# Altium schematic sheet PWR_MGMT.SchDoc
size B; SheetNumber: 3; SheetTotal: 5
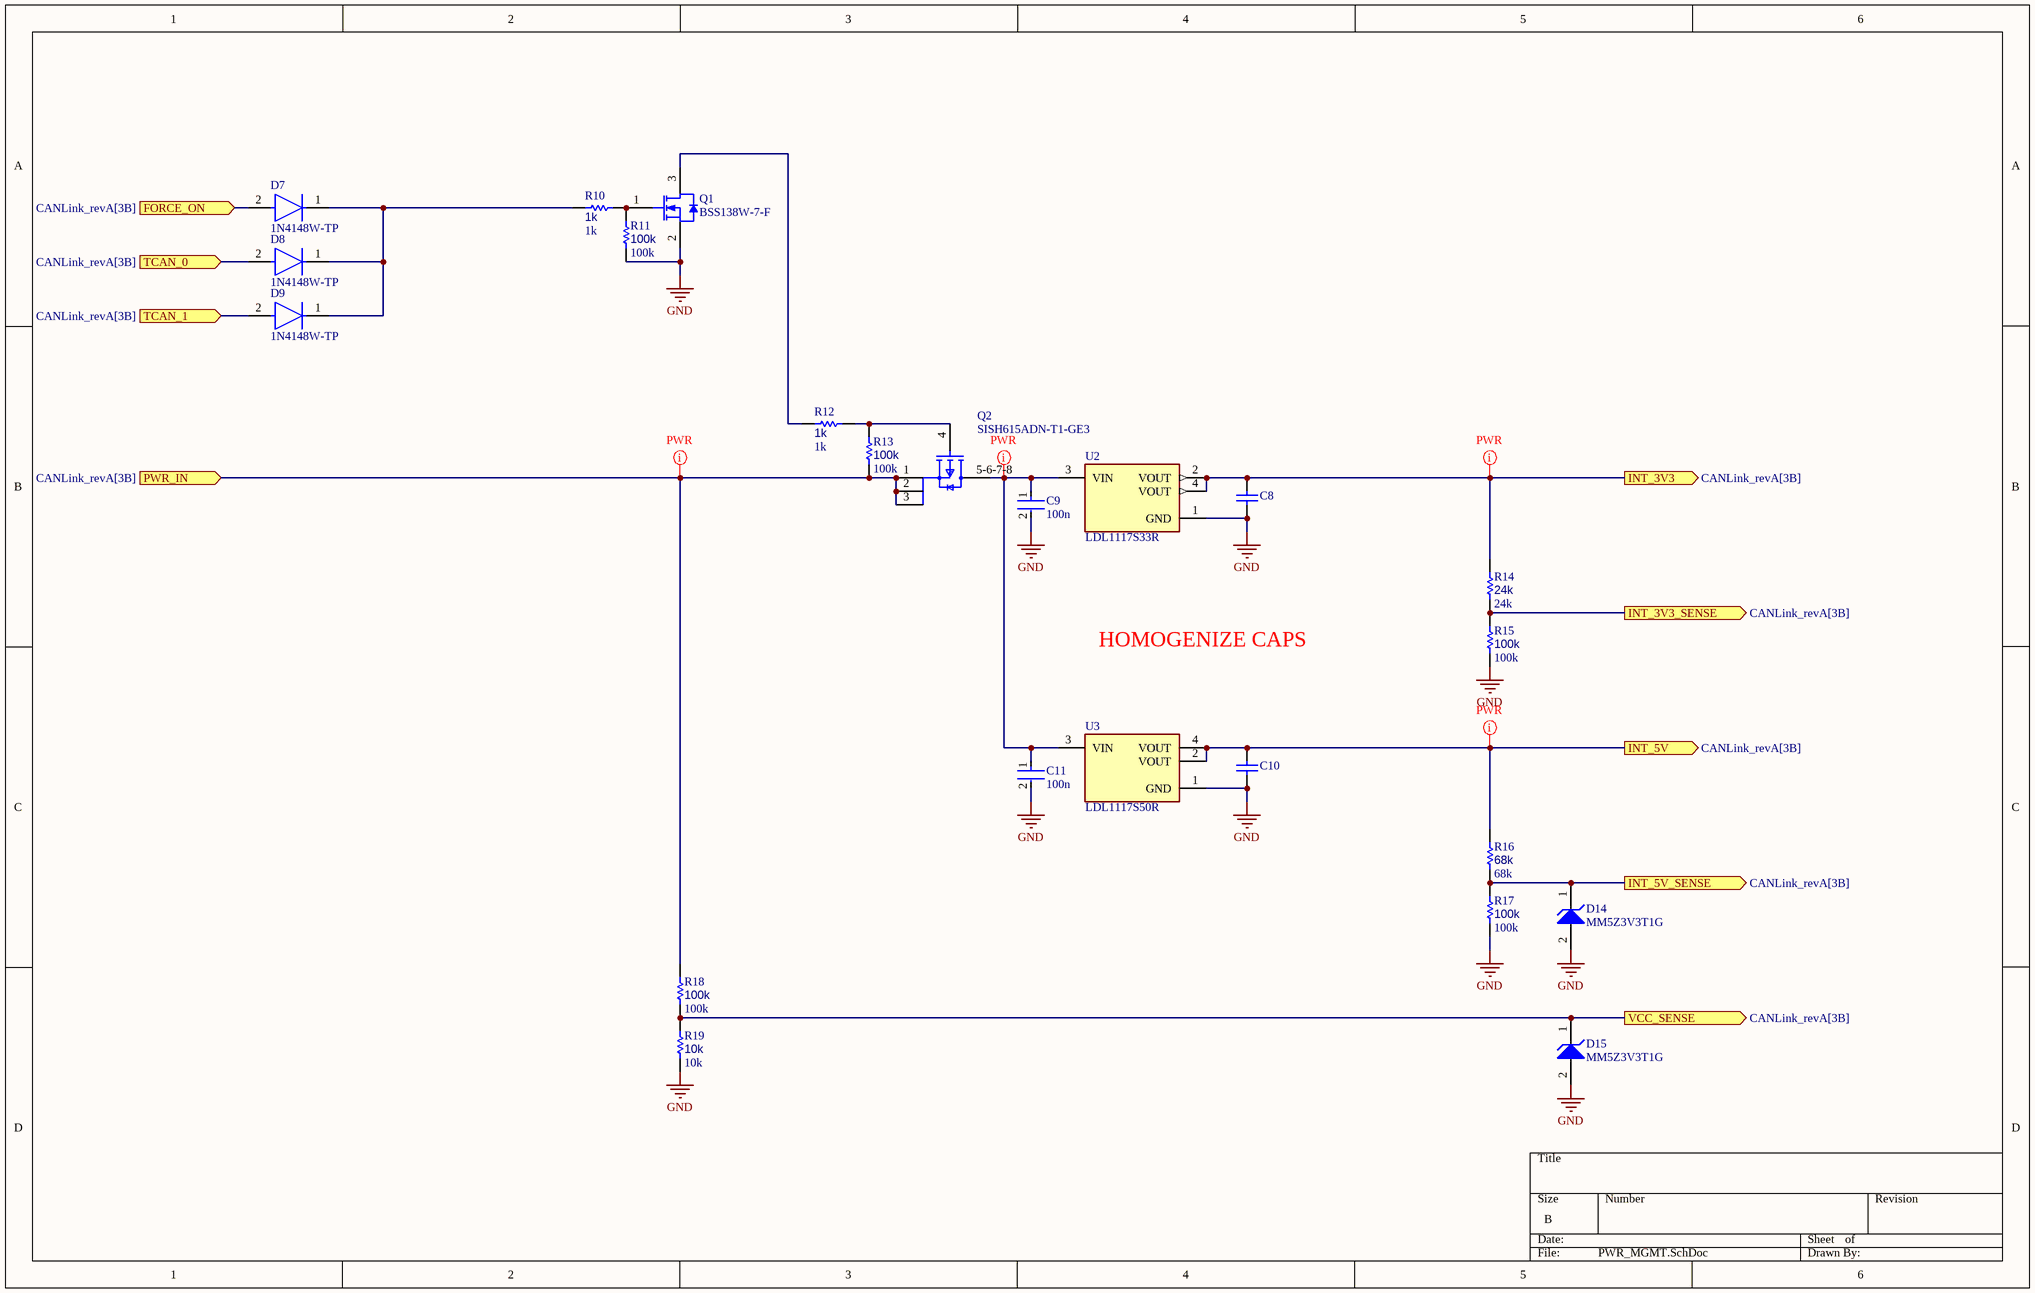
[diagram p0: PWR_MGMT.SchDoc]

## Parts
C8  0805ZG106ZAT2A  [CAPC2013X152X50NL20T25]  (value not drawn)
C9  100n  [FP-0402-L_1_0_0_05-W_0_5-IPC_A]
C10  0805ZG106ZAT2A  [CAPC2013X152X50NL20T25]  (value not drawn)
C11  100n  [FP-0402-L_1_0_0_05-W_0_5-IPC_A]
D7  1N4148W-TP  [FP-SOD-123-IPC_A]
D8  1N4148W-TP  [FP-SOD-123-IPC_A]
D9  1N4148W-TP  [FP-SOD-123-IPC_A]
D14  MM5Z3V3T1G  [ONSC-SOD-523-2-502-01_V]
D15  MM5Z3V3T1G  [ONSC-SOD-523-2-502-01_V]
Q1  BSS138W-7-F  [DIOD-SOT323-3_V]
Q2  SISH615ADN-T1-GE3  [SISH615ADN-T1-GE3-Footprint-1]
R10  1k  [R0603B]
R11  100k  [R0603B]
R12  1k  [R0603B]
R13  100k  [R0603B]
R14  24k  [R0603B]
R15  100k  [R0603B]
R16  68k  [R0603B]
R17  100k  [R0603B]
R18  100k  [R0603B]
R19  10k  [R0603B]
U2  LDL1117S33R  [FP-SOT223-0046067-IPC_C]
U3  LDL1117S50R  [FP-SOT-223-0046067_14-MFG]

## Ports
FORCE_ON (in, see CANLink_revA[3B]), INT_3V3 (out, see CANLink_revA[3B]), INT_3V3_SENSE (out, see CANLink_revA[3B]), INT_5V (out, see CANLink_revA[3B]), INT_5V_SENSE (out, see CANLink_revA[3B]), PWR_IN (in, see CANLink_revA[3B]), TCAN_0 (in, see CANLink_revA[3B]), TCAN_1 (in, see CANLink_revA[3B]), VCC_SENSE (out, see CANLink_revA[3B])

## Nets
GND: C8.1 C9.2 C10.1 C11.2 D14.2(A) D15.2(A) Q1.2(S) R11.2 R15.2 R17.2 R19.2 U2.1(GND) U3.1(GND)
FORCE_ON: D7.2(A) ; port FORCE_ON
INT_3V3: C8.2 R14.1 U2.2(VOUT) U2.4(VOUT) ; port INT_3V3
INT_3V3_SENSE: R14.2 R15.1 ; port INT_3V3_SENSE
INT_5V: C10.2 R16.1 U3.2(VOUT) U3.4(VOUT) ; port INT_5V
INT_5V_SENSE: D14.1(K) R16.2 R17.1 ; port INT_5V_SENSE
PWR_IN: Q2.1(S) Q2.2(S) Q2.3(S) R13.2 R18.1 ; port PWR_IN
TCAN_0: D8.2(A) ; port TCAN_0
TCAN_1: D9.2(A) ; port TCAN_1
VCC_SENSE: D15.1(K) R18.2 R19.1 ; port VCC_SENSE
NetC9_1: C9.1 C11.1 Q2.5-6-7-8(D) U2.3(VIN) U3.3(VIN)
NetD7_1: D7.1(C) D8.1(C) D9.1(C) R10.2
NetQ1_1: Q1.1(G) R10.1 R11.1
NetQ1_3: Q1.3(D) R12.2
NetQ2_4: Q2.4(G) R12.1 R13.1

## Layout directives
net class PWR: INT_3V3, INT_5V, NetC9_1, PWR_IN

## Notes on the sheet
- HOMOGENIZE CAPS

## Library data of the parts
C8 C10 = CMP-2007-04523-1: Manufacturer: AVX Interconnect / Elco; Part Number: 0805ZG106ZAT2A
C9 C11 = CMP-001-00058-1: LARGE PADS, 0402 CAP, CHANGE COMMENT TO MATCH REAL P/N; Capacitor Type: Ceramic; Min Operating Temperature: -55°C; Mounting Technology: Surface Mount; Pins: 2; Case/Package: 0402; RoHS Compliant: Yes; Max Operating Temperature: 85°C
D7-D9 = CMP-2000-04993-2: DIODE GEN PURP 100V 150MA SOD123; Max Reverse Leakage Current: 5uA; Max Surge Current: 2A; Reverse Recovery Time: 4ns; Polarity: Standard; Capacitance: 4pF; Max Forward Surge Current (Ifsm): 1A; Element Configuration: Single; Power Dissipation: 400mW; Forward Voltage: 1V; Radiation Hardening: No; Lead Free: Lead Free; Max Reverse Voltage (DC): 100V; Current Rating: 150mA; Forward Current: 150mA; Packaging: Tape and Reel; Number of Pins: 2; Package Quantity: 3000; Max Operating Temperature: 150°C; Min Operating Temperature: -65°C; Average Rectified Current: 150mA; Recovery Time: 4ns; Output Current: 150mA; Peak Non-Repetitive Surge Current: 2A; Width: 1.8mm; Voltage Rating (DC): 100V; Height: 1.2mm; Max Repetitive Reverse Voltage (Vrrm): 100V; Mount: Surface Mount; Length: 2.85mm
D14 D15 = CMP-1060-00750-1: Zener Voltage Regulator, 500 mW, 2-Pin SOD-523, Pb-Free, Tape and Reel; Manufacturer: On Semiconductor; P Max (W): 0.5; VZ Typ (V): 3.3; RoHS: Pb-Free; ComponentLink2Description: Datasheet; PackageReference: SOD-523-2-502-01; DatasheetVersion: Rev. 10; ComponentLink1Description: Manufacturer URL; PackageVersion: Rev. E, 09/2010; ComponentLink3URL: http://www.onsemi.com/pub_link/Collateral/502-01.PDF; ComponentLink2URL: http://www.onsemi.cn/pub_link/Collateral/MM5Z2V4T1-D.PDF; Mounting Technology: Surface Mount; PartNumber: MM5Z3V3T1G; Packing: Tape and Reel; PackageDescription: 2-Pin SOD, Body 1.2 x 0.8 mm; ComponentLink1URL: http://www.onsemi.com/; ComponentLink3Description: Package Specification
Q1 = CMP-2000-05968-1: N-Channel Enhancement Mode Mosfet, 50 V, 200 mA, -55 to 150 degC, 6-Pin SOT-323, RoHS, Tape and Reel; Typical Turn-Off Delay Time: 20ns; Number of Channels: 1Channel; Type: EnhancementModeFieldEffectTransistor; Brand: DiodesIncorporated; Vds - Drain-Source Breakdown Voltage: 75V; Vgs - Gate-Source Voltage: 20V; Rds On - Drain-Source Resistance: 1.4Ohms; Transistor Type: 1N-Channel; Configuration: Single; Unit Weight: 0.000212oz; Pd - Power Dissipation: 200mW; Id - Continuous Drain Current: 200mA; Forward Transconductance - Min: 0.1S; Manufacturer URL: http://www.diodes.com/; Series: BSS138; Package Description: 3-Pin Small Outline Transistor, Body 2 x 1.25 mm, Pitch 0.65 mm; Mounting Technology: SurfaceMount; Product Category: MOSFET; RoHS: True; Maximum Operating Temperature: +150C; Height: 1mm; Length: 2.2mm; Technology: Si; Width: 1.35mm; Datasheet URL: http://www.diodes.com/_files/datasheets/ds30206.pdf; Manufacturer: DiodesIncorporated; Package / Case: SOT-323-3; Typical Turn-On Delay Time: 20ns; Transistor Polarity: N-Channel; Factory Pack Quantity: 3000; Packaging: Reel; Product: MOSFETSmallSignal; Datasheet Version: Rev. 11-2, 09/2013; Package Reference: SOT323; Minimum Operating Temperature: -55C; Mounting Style: SMD/SMT; Channel Mode: Enhancement
Q2 = CMP-013-00018-2: Trans MOSFET P-CH 20V 22.1A 8-Pin PowerPAK 1212 EP T/R; Source: SISH615ADN-T1-GE3.SchLib; Design Item ID: CMP-013-00036-4; Component Type: Standard; Pins: 5
R10-R19 = CMP-009-00002-14: Resistor
  R10 R12: Value: 1k
  R11 R13 R15 R17 R18: Value: 100k
  R14: Value: 24k
  R16: Value: 68k
  R19: Value: 10k
U2 = CMP-12153-000006-1: IC REG LINEAR 3.3V 1.2A SOT223; Manufacturer: STMicroelectronics; Output Type: Fixed; Min Supply Voltage: 2.6V; Number Of Outputs: 1; Dropout Voltage: 350mV; Output Current: 2A; Nominal Supply Current: 250uA; Standoff Height: 0.02mm; Max Supply Voltage: 18V; Max Junction Temp: +125°C; Accuracy Percentage: 2%; Automotive: No; Device Class L2: Power Management ICs; Height: 1.9mm; Octopart: https://octopart.com/ldl1117s33r-stmicroelectronics-81876163; Output Voltage: 3.3V; Package: SOT223-0046067; Lead Free: Yes; Temperature Range Low: -40°C; Category: IC; Device Class L1: Integrated Circuits (ICs); Ipc Land Pattern Name: SOT230P700X190-4; Mouser Description: LDL1117 Series 1.2 A 3.3 V High PSRR LDO Linear Voltage Regulator-SOT-223; ComponentLink2Description: Datasheet; ComponentLink2URL: https://www.st.com/resource/en/datasheet/ldl1117.pdf; Device Class L3: Voltage Regulators - Linear; Manufacturer Part Number: LDL1117S33R; Temperature Range High: +125°C; Digikey Description: IC REG LINEAR 3.3V 1.2A SOT223; Temperature: -40°C to +125°C; RoHS: TRUE
U3 = CMP-12153-000005-1: IC REG LINEAR 5V 1.2A SOT223; Manufacturer: STMicroelectronics; Standoff Height: 0.02mm; Min Supply Voltage: 2.6V; Nominal Supply Current: 250uA; Max Junction Temp: +150°C; Accuracy Percentage: 2%; Output Type: Fixed; Max Supply Voltage: 18V; Output Current: 2A; Number Of Outputs: 1; Dropout Voltage: 350mV; ComponentLink2Description: Datasheet; Temperature Range High: +125°C; Manufacturer Part Number: LDL1117S50R; Digikey Description: IC REG LINEAR 5V 1.2A SOT223; Device Class L2: Power Management ICs; RoHS: TRUE; Temperature: -40°C to +125°C; Device Class L3: Voltage Regulators - Linear; Automotive: No; Mouser Description: LDL1117 Series 1.2 A 5 V High PSRR LDO Linear Voltage Regulator - SOT-223; Package: SOT-223-0046067_14; ComponentLink2URL: https://www.st.com/content/ccc/resource/technical/document/datasheet/group3/0e/5a/00/ca/10/1a/4f/a5/DM00366442/files/DM00366442.pdf/jcr:content/translations/en.DM00366442.pdf; Output Voltage: 5V; Octopart: https://octopart.com/ldl1117s50r-stmicroelectronics-81876164; Category: IC; Device Class L1: Integrated Circuits (ICs); Temperature Range Low: -40°C; Height: 1.9mm; Lead Free: Yes